# EAGLE schematic eBay1 (EAGLE 6.6.0)
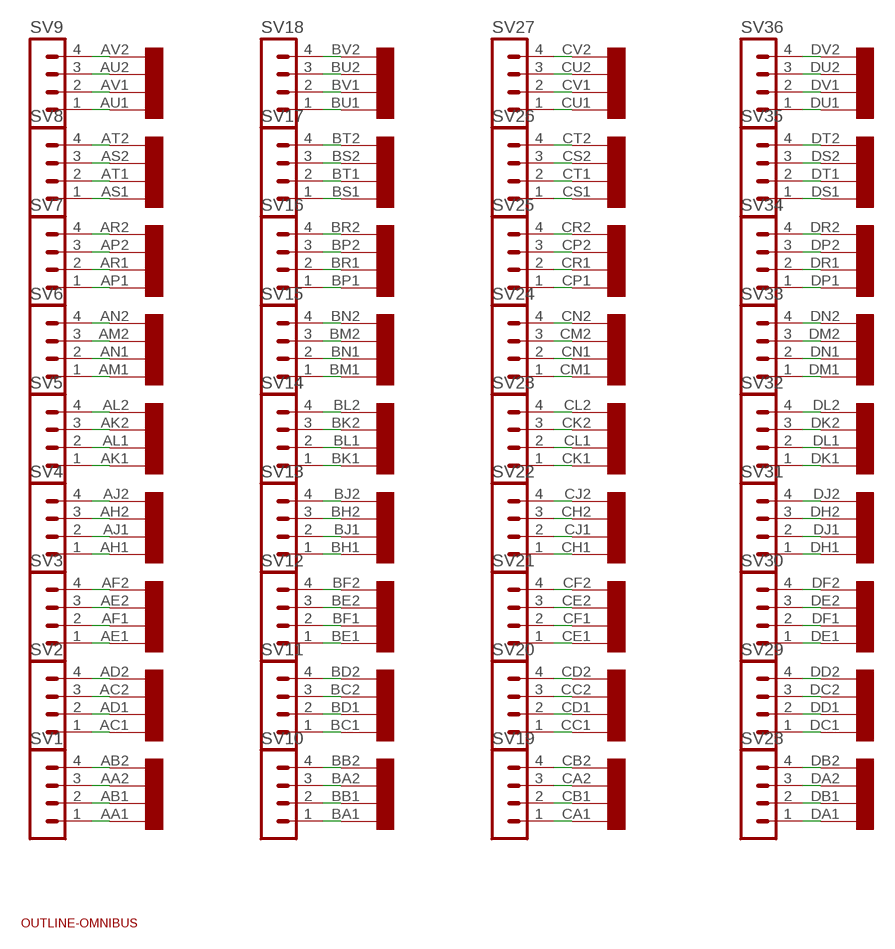
[diagram p0: schematic, sheet 1]

## Parts
SV1  MA04-1  [MA04-1]
SV2  MA04-1  [MA04-1]
SV3  MA04-1  [MA04-1]
SV4  MA04-1  [MA04-1]
SV5  MA04-1  [MA04-1]
SV6  MA04-1  [MA04-1]
SV7  MA04-1  [MA04-1]
SV8  MA04-1  [MA04-1]
SV9  MA04-1  [MA04-1]
SV10  MA04-1  [MA04-1]
SV11  MA04-1  [MA04-1]
SV12  MA04-1  [MA04-1]
SV13  MA04-1  [MA04-1]
SV14  MA04-1  [MA04-1]
SV15  MA04-1  [MA04-1]
SV16  MA04-1  [MA04-1]
SV17  MA04-1  [MA04-1]
SV18  MA04-1  [MA04-1]
SV19  MA04-1  [MA04-1]
SV20  MA04-1  [MA04-1]
SV21  MA04-1  [MA04-1]
SV22  MA04-1  [MA04-1]
SV23  MA04-1  [MA04-1]
SV24  MA04-1  [MA04-1]
SV25  MA04-1  [MA04-1]
SV26  MA04-1  [MA04-1]
SV27  MA04-1  [MA04-1]
SV28  MA04-1  [MA04-1]
SV29  MA04-1  [MA04-1]
SV30  MA04-1  [MA04-1]
SV31  MA04-1  [MA04-1]
SV32  MA04-1  [MA04-1]
SV33  MA04-1  [MA04-1]
SV34  MA04-1  [MA04-1]
SV35  MA04-1  [MA04-1]
SV36  MA04-1  [MA04-1]
U$1  OUTLINE-OMNIBUS  [OMNIBUS]
U$2  QUAD  [EDGE-CON8]

## Nets
N$926: SV1.1 U$2.AA1
N$927: SV1.2 U$2.AB1
N$928: SV1.3 U$2.AA2
N$946: SV1.4 U$2.AB2
N$947: SV2.1 U$2.AC1
N$948: SV2.2 U$2.AD1
N$951: SV2.3 U$2.AC2
N$952: SV2.4 U$2.AD2
N$953: SV3.1 U$2.AE1
N$971: SV3.2 U$2.AF1
N$972: SV4.1 U$2.AH1
N$973: SV4.2 U$2.AJ1
N$976: SV5.1 U$2.AK1
N$977: SV5.2 U$2.AL1
N$978: SV6.1 U$2.AM1
N$996: SV6.2 U$2.AN1
N$997: SV7.1 U$2.AP1
N$998: SV7.2 U$2.AR1
N$2462: SV8.1 U$2.AS1
N$2463: SV8.2 U$2.AT1
N$2464: SV9.1 U$2.AU1
N$2482: SV9.2 U$2.AV1
N$2483: SV3.3 U$2.AE2
N$2484: SV3.4 U$2.AF2
N$2485: SV4.3 U$2.AH2
N$2486: SV4.4 U$2.AJ2
N$2487: SV5.3 U$2.AK2
N$2505: SV5.4 U$2.AL2
N$2506: SV6.3 U$2.AM2
N$2507: SV6.4 U$2.AN2
N$2508: SV7.3 U$2.AP2
N$2509: SV7.4 U$2.AR2
N$2510: SV8.3 U$2.AS2
N$2528: SV8.4 U$2.AT2
N$2529: SV9.3 U$2.AU2
N$2530: SV9.4 U$2.AV2
N$4072: SV10.1 U$2.BA1
N$4073: SV10.2 U$2.BB1
N$4074: SV11.1 U$2.BC1
N$4092: SV11.2 U$2.BD1
N$4093: SV12.1 U$2.BE1
N$4094: SV12.2 U$2.BF1
N$4095: SV13.1 U$2.BH1
N$4096: SV13.2 U$2.BJ1
N$4097: SV14.1 U$2.BK1
N$4115: SV14.2 U$2.BL1
N$4116: SV15.1 U$2.BM1
N$4117: SV15.2 U$2.BN1
N$4118: SV16.1 U$2.BP1
N$4119: SV16.2 U$2.BR1
N$4120: SV17.1 U$2.BS1
N$4138: SV17.2 U$2.BT1
N$4139: SV18.1 U$2.BU1
N$4140: SV18.2 U$2.BV1
N$5683: SV10.3 U$2.BA2
N$5684: SV10.4 U$2.BB2
N$5685: SV11.3 U$2.BC2
N$5703: SV11.4 U$2.BD2
N$5704: SV12.3 U$2.BE2
N$5706: SV12.4 U$2.BF2
N$5707: SV13.3 U$2.BH2
N$5708: SV13.4 U$2.BJ2
N$5726: SV14.3 U$2.BK2
N$5727: SV14.4 U$2.BL2
N$5729: SV15.3 U$2.BM2
N$5730: SV15.4 U$2.BN2
N$5731: SV16.3 U$2.BP2
N$5749: SV16.4 U$2.BR2
N$5750: SV18.4 U$2.BV2
N$6441: SV18.3 U$2.BU2
N$6442: SV17.4 U$2.BT2
N$6443: SV17.3 U$2.BS2
N$6444: SV19.1 U$2.CA1
N$6445: SV19.2 U$2.CB1
N$6446: SV20.1 U$2.CC1
N$6447: SV20.2 U$2.CD1
N$6448: SV21.1 U$2.CE1
N$6449: SV21.2 U$2.CF1
N$6450: SV22.1 U$2.CH1
N$6451: SV22.2 U$2.CJ1
N$6452: SV19.3 U$2.CA2
N$6453: SV19.4 U$2.CB2
N$6454: SV20.3 U$2.CC2
N$6455: SV20.4 U$2.CD2
N$6456: SV21.3 U$2.CE2
N$6457: SV21.4 U$2.CF2
N$6458: SV22.3 U$2.CH2
N$6459: SV22.4 U$2.CJ2
N$6460: SV23.1 U$2.CK1
N$6461: SV23.2 U$2.CL1
N$6462: SV24.1 U$2.CM1
N$6463: SV24.2 U$2.CN1
N$6464: SV25.1 U$2.CP1
N$6465: SV25.2 U$2.CR1
N$6466: SV26.1 U$2.CS1
N$6467: SV26.2 U$2.CT1
N$6468: SV27.1 U$2.CU1
N$6469: SV27.2 U$2.CV1
N$6470: SV23.3 U$2.CK2
N$6471: SV23.4 U$2.CL2
N$6472: SV24.3 U$2.CM2
N$6473: SV24.4 U$2.CN2
N$6474: SV25.3 U$2.CP2
N$6475: SV25.4 U$2.CR2
N$6476: SV26.3 U$2.CS2
N$6477: SV26.4 U$2.CT2
N$6478: SV27.3 U$2.CU2
N$6479: SV27.4 U$2.CV2
N$6480: SV28.1 U$2.DA1
N$6481: SV28.2 U$2.DB1
N$6482: SV29.1 U$2.DC1
N$6483: SV29.2 U$2.DD1
N$6484: SV30.1 U$2.DE1
N$6485: SV30.2 U$2.DF1
N$6486: SV31.1 U$2.DH1
N$6487: SV31.2 U$2.DJ1
N$6488: SV32.1 U$2.DK1
N$6489: SV32.2 U$2.DL1
N$6490: SV33.1 U$2.DM1
N$6491: SV33.2 U$2.DN1
N$6492: SV34.1 U$2.DP1
N$6493: SV34.2 U$2.DR1
N$6494: SV35.1 U$2.DS1
N$6495: SV35.2 U$2.DT1
N$6496: SV36.1 U$2.DU1
N$6497: SV36.2 U$2.DV1
N$6498: SV36.4 U$2.DV2
N$6499: SV36.3 U$2.DU2
N$6500: SV35.4 U$2.DT2
N$6501: SV35.3 U$2.DS2
N$6502: SV34.4 U$2.DR2
N$6503: SV34.3 U$2.DP2
N$6504: SV28.3 U$2.DA2
N$6505: SV28.4 U$2.DB2
N$6506: SV29.3 U$2.DC2
N$6507: SV29.4 U$2.DD2
N$6508: SV30.3 U$2.DE2
N$6509: SV30.4 U$2.DF2
N$6510: SV31.3 U$2.DH2
N$6511: SV31.4 U$2.DJ2
N$6512: SV32.3 U$2.DK2
N$6513: SV32.4 U$2.DL2
N$6514: SV33.3 U$2.DM2
N$6515: SV33.4 U$2.DN2

## Library data of the parts
SV1-SV36 = con-lstb:MA04-1: PIN HEADER; OC_FARNELL: unknown; OC_NEWARK: unknown
U$1 = dec-con:OUTLINE-*: Board outlines for DEC boards.
U$2 = dec-con:QUAD: Quad-Height DEC board

## Net classes
0 default: width 0.813 mm